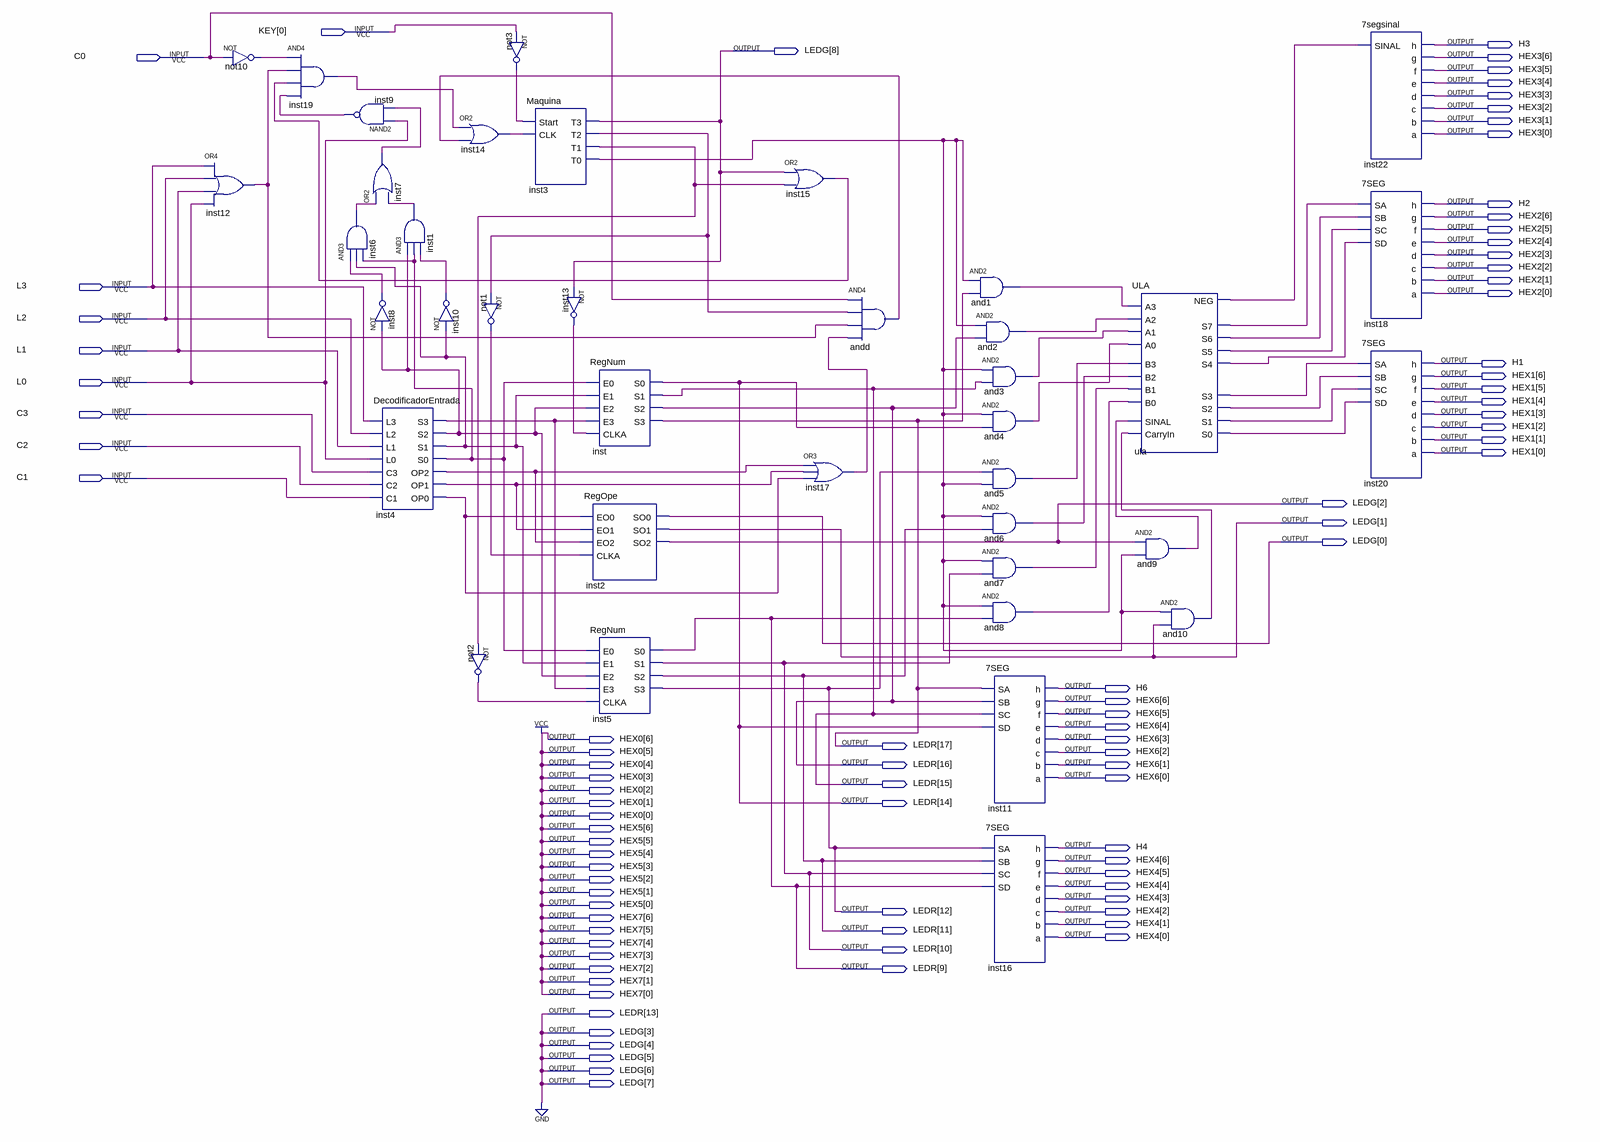
[diagram p0: schematic sheet]
// Quartus schematic Projeto.bdf as structural Verilog: 38 symbols, 88 pins
module Projeto (
  input  [0:0] KEY,
  input  C0,
  input  L3,
  input  L2,
  input  L1,
  input  L0,
  input  C3,
  input  C2,
  input  C1,
  output H3,
  output [8:0] LEDG,
  output [6:0] HEX3,
  output H2,
  output [6:0] HEX2,
  output H1,
  output [6:0] HEX1,
  output H6,
  output [6:0] HEX6,
  output [6:0] HEX0,
  output [17:9] LEDR,
  output [6:0] HEX5,
  output H4,
  output [6:0] HEX4,
  output [6:0] HEX7
);

  wire and1_out, and2_out, and3_out, and4_out, and5_out, and6_out, and7_out, and8_out, and9_out, and10_out,
       andd_out, inst1_out, inst3_t0, inst3_t1, inst3_t2, inst4_op0, inst4_op1, inst4_op2, inst4_s0,
       inst4_s1, inst4_s2, inst4_s3, inst6_out, inst7_out, inst8_out, inst9_out, inst10_out, inst12_out,
       inst13_out, inst14_out, inst15_out, inst17_out, inst19_out, not1_out, not2_out, not3_out, not10_out,
       ula_neg, ula_s0, ula_s1, ula_s2, ula_s3, ula_s4, ula_s5, ula_s6, ula_s7;

  or inst12 (inst12_out, L3, L2, L1, L0);
  not not10 (not10_out, C0);
  and inst19 (inst19_out, not10_out, inst12_out, inst15_out, inst9_out);
  nand inst9 (inst9_out, L0, inst7_out);
  or inst7 (inst7_out, inst6_out, inst1_out);
  and inst6 (inst6_out, inst8_out, inst4_s1, inst4_s0);
  and inst1 (inst1_out, inst4_s2, inst4_s0, inst10_out);
  not inst8 (inst8_out, inst4_s2);
  DecodificadorEntrada inst4 (
    .L3(L3), .L2(L2), .L1(L1), .L0(L0), .C3(C3), .C2(C2), .C1(C1), .S3(inst4_s3), .S2(inst4_s2),
    .S1(inst4_s1), .S0(inst4_s0), .OP2(inst4_op2), .OP1(inst4_op1), .OP0(inst4_op0));
  or inst14 (inst14_out, inst19_out, andd_out);
  not inst10 (inst10_out, inst4_s1);
  not not2 (not2_out, inst3_t1);
  not not3 (not3_out, KEY[0]);
  not not1 (not1_out, inst3_t2);
  Maquina inst3 (.Start(not3_out), .CLK(inst14_out), .T3(LEDG[8]), .T2(inst3_t2), .T1(inst3_t1), .T0(inst3_t0));
  not inst13 (inst13_out, LEDG[8]);
  RegNum inst (
    .E0(inst4_s0), .E1(inst4_s1), .E2(inst4_s2), .E3(inst4_s3), .CLKA(inst13_out), .S0(LEDR[14]),
    .S1(LEDR[15]), .S2(LEDR[16]), .S3(LEDR[17]));
  RegOpe inst2 (
    .EO0(inst4_op0), .EO1(inst4_op1), .EO2(inst4_op2), .CLKA(not1_out), .SO0(LEDG[0]), .SO1(LEDG[1]),
    .SO2(LEDG[2]));
  RegNum inst5 (
    .E0(inst4_s0), .E1(inst4_s1), .E2(inst4_s2), .E3(inst4_s3), .CLKA(not2_out), .S0(LEDR[9]), .S1(LEDR[10]),
    .S2(LEDR[11]), .S3(LEDR[12]));
  or inst15 (inst15_out, LEDG[8], inst3_t1);
  or inst17 (inst17_out, inst4_op2, inst4_op1, inst4_op0);
  and andd (andd_out, C0, inst3_t2, inst12_out, inst17_out);
  and and1 (and1_out, inst3_t0, LEDR[17]);
  and and2 (and2_out, inst3_t0, LEDR[16]);
  and and3 (and3_out, inst3_t0, LEDR[15]);
  and and4 (and4_out, inst3_t0, LEDR[14]);
  and and5 (and5_out, LEDR[12], inst3_t0);
  and and6 (and6_out, inst3_t0, LEDR[11]);
  and and7 (and7_out, inst3_t0, LEDR[10]);
  and and8 (and8_out, inst3_t0, LEDR[9]);
  \7SEG  inst11 (
    .SA(LEDR[17]), .SB(LEDR[16]), .SC(LEDR[15]), .SD(LEDR[14]), .h(H6), .g(HEX6[6]), .f(HEX6[5]),
    .e(HEX6[4]), .d(HEX6[3]), .c(HEX6[2]), .b(HEX6[1]), .a(HEX6[0]));
  \7SEG  inst16 (
    .SA(LEDR[12]), .SB(LEDR[11]), .SC(LEDR[10]), .SD(LEDR[9]), .h(H4), .g(HEX4[6]), .f(HEX4[5]), .e(HEX4[4]),
    .d(HEX4[3]), .c(HEX4[2]), .b(HEX4[1]), .a(HEX4[0]));
  ULA ula (
    .CarryIn(and10_out), .A3(and1_out), .A2(and2_out), .A1(and3_out), .A0(and4_out), .B3(and5_out),
    .B2(and6_out), .B1(and7_out), .B0(and8_out), .SINAL(and9_out), .NEG(ula_neg), .S7(ula_s7), .S6(ula_s6),
    .S5(ula_s5), .S4(ula_s4), .S3(ula_s3), .S2(ula_s2), .S1(ula_s1), .S0(ula_s0));
  and and9 (and9_out, LEDG[2], inst3_t0);
  and and10 (and10_out, inst3_t0, LEDG[1]);
  \7segsinal  inst22 (
    .SINAL(ula_neg), .h(H3), .g(HEX3[6]), .f(HEX3[5]), .e(HEX3[4]), .d(HEX3[3]), .c(HEX3[2]), .b(HEX3[1]),
    .a(HEX3[0]));
  \7SEG  inst18 (
    .SA(ula_s7), .SB(ula_s6), .SC(ula_s5), .SD(ula_s4), .h(H2), .g(HEX2[6]), .f(HEX2[5]), .e(HEX2[4]),
    .d(HEX2[3]), .c(HEX2[2]), .b(HEX2[1]), .a(HEX2[0]));
  \7SEG  inst20 (
    .SA(ula_s3), .SB(ula_s2), .SC(ula_s1), .SD(ula_s0), .h(H1), .g(HEX1[6]), .f(HEX1[5]), .e(HEX1[4]),
    .d(HEX1[3]), .c(HEX1[2]), .b(HEX1[1]), .a(HEX1[0]));

  assign HEX0 = {7{1'b1}};
  assign HEX5 = {7{1'b1}};
  assign HEX7 = {7{1'b1}};
  assign LEDG[7:3] = {5{1'b0}};
  assign LEDR[13] = 1'b0;
endmodule
